# EAGLE schematic EEprom_Logger_V1_20202_04_13_A (EAGLE 9.4.2)
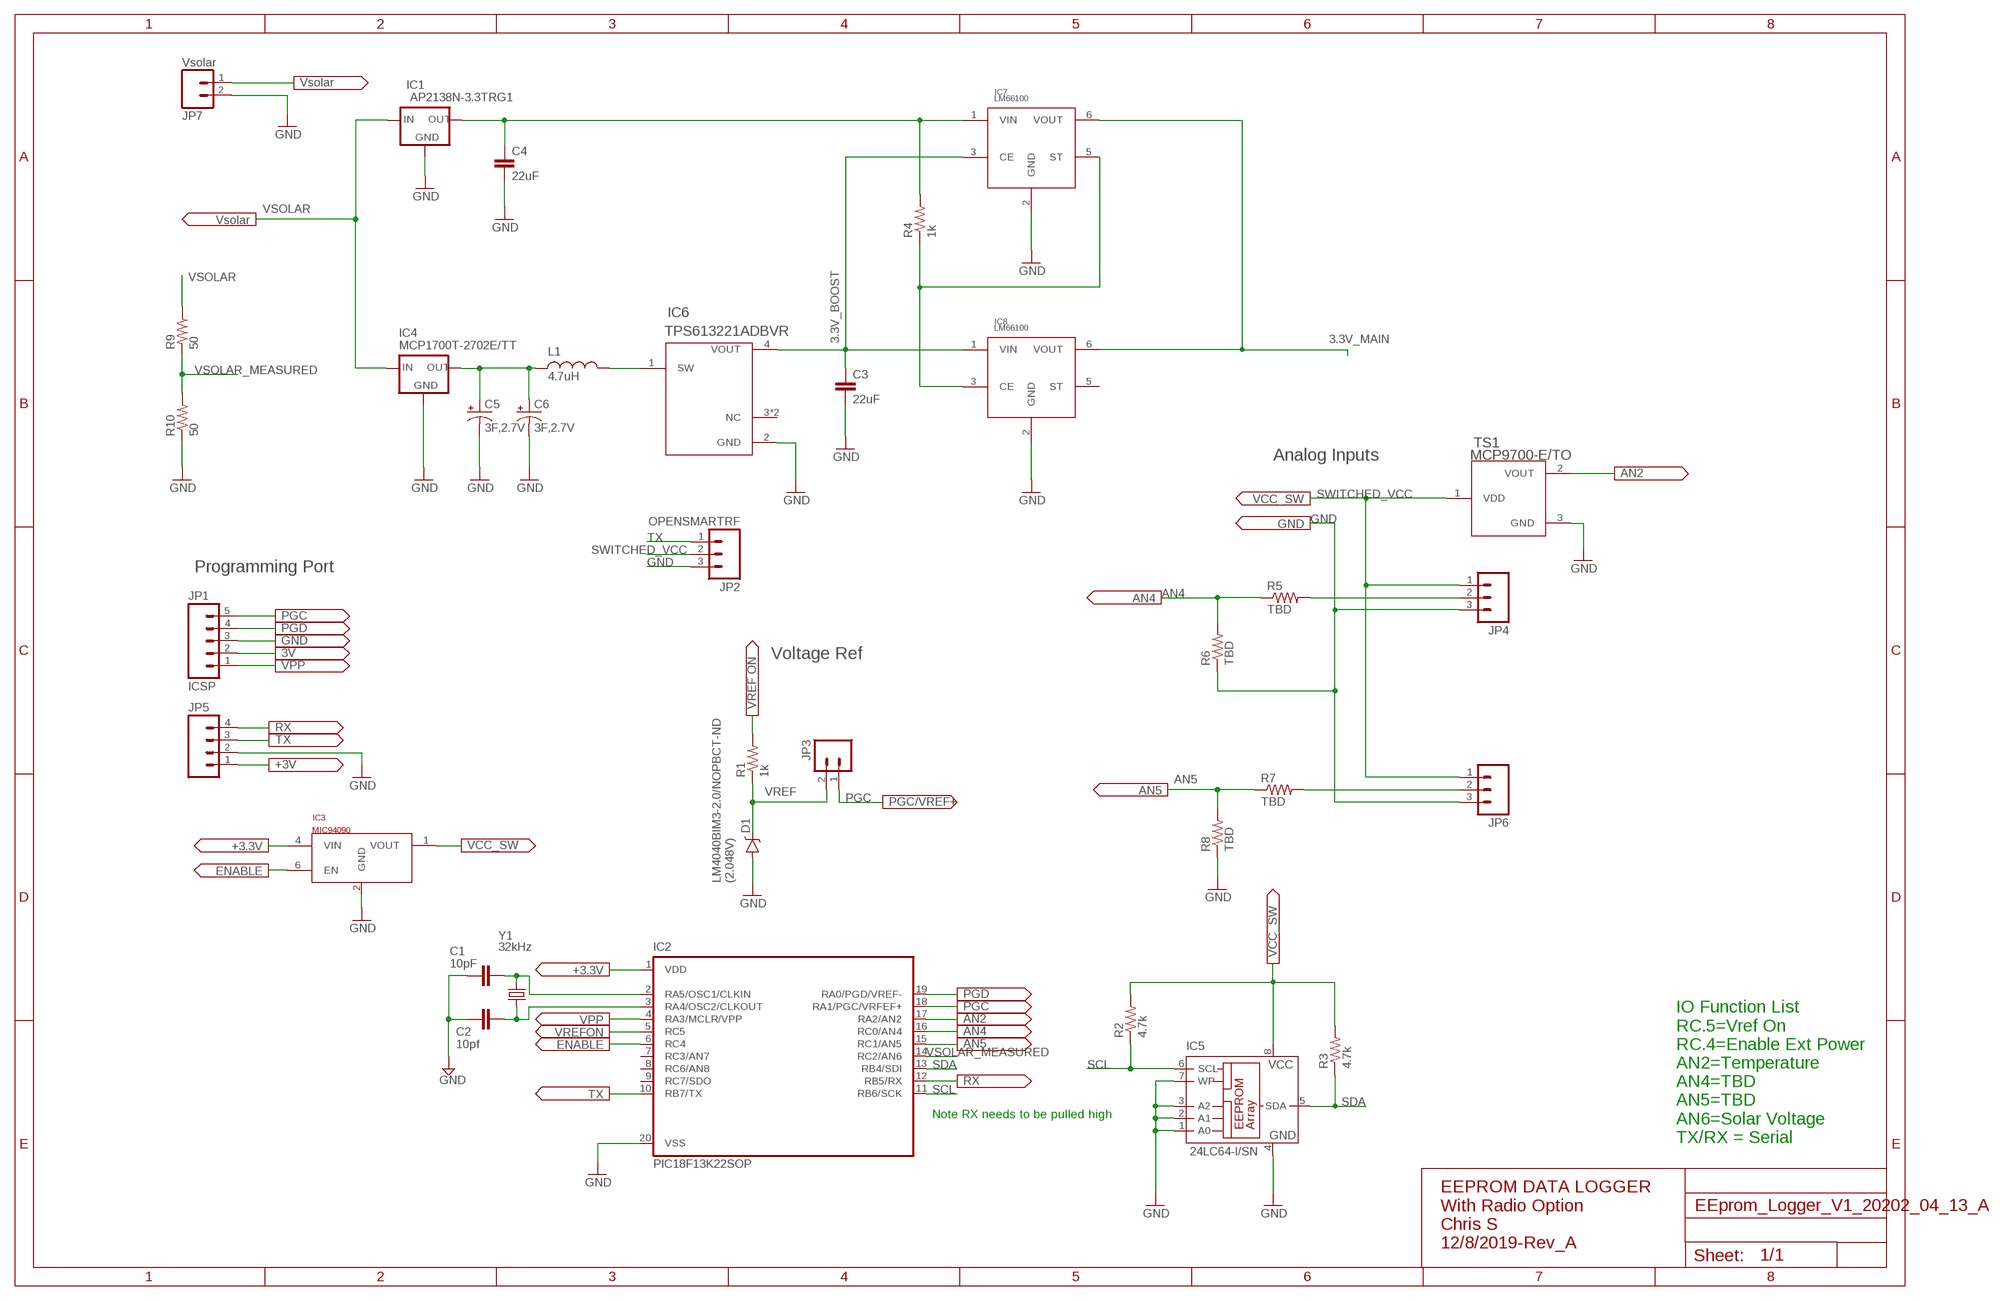
[diagram p0: schematic, sheet 1]

## Parts
C1  10pF  CAP1206  [1206]
C2  10pf  CAP1206  [1206]
C3  22uF  CAP1206  [1206]
C4  22uF  CAP1206  [1206]
C5  3F,2.7V  CPOL-USE3.5-8  [E3,5-8]
C6  3F,2.7V  CPOL-USE3.5-8  [E3,5-8]
D1  V-REFERENCESMD  [SOT23-3]
IC1  AP2138N-3.3TRG1  XC63FPM  [SOT23]
IC2  PIC18F13K22SOP  [SOP20W]
IC3  MIC94090  [SC-70]
IC4  MCP1700T-2702E/TT  XC63FPM  [SOT23]
IC5  24LC64-I/SN  24LC16BSN  [SO-08]
IC6  TPS613221ADBVR  TPS61322  [DBV5-L]
IC7  LM66100  [SC70-6]
IC8  LM66100  [SC70-6]
JP1  ICSP  M05PTH  [1X05]
JP2  OPENSMARTRF  M03LONGPADS  [1X03_LONGPADS@1]
JP3  M02LOCK  [1X02_LOCK]
JP4  455-1750-1-ND  CONN_03  [1X03]
JP5  M04PTH  [1X04]
JP6  455-1750-1-ND  CONN_03  [1X03]
JP7  Vsolar  CONN_02POLAR_LOCK  [MOLEX-1X2_LOCK@1]
L1  4.7uH  INDUCTOR1210  [1210]
R1  1k  RESISTOR1206  [1206]
R2  4.7k  RESISTOR1206  [1206]
R3  4.7k  RESISTOR1206  [1206]
R4  1k  RESISTOR1206  [1206]
R5  TBD  RESISTOR1206  [1206]
R6  TBD  RESISTOR1206  [1206]
R7  TBD  RESISTOR1206  [1206]
R8  TBD  RESISTOR1206  [1206]
R9  50  RESISTOR1206  [1206]
R10  50  RESISTOR1206  [1206]
TS1  MCP9700-E/TO  [TO-92-AMMO]
Y1  32kHz  CRYSTALTC26V  [TC26V]

## Nets
3.3V_BOOST: C3.2 IC6.4(VOUT) IC7.3(CE) IC8.1(VIN)
3.3V_MAIN: IC2.1(VDD) IC3.4(VIN) IC7.6(VOUT) IC8.6(VOUT) JP1.2 JP5.1
AN2: IC2.17(RA2/AN2) TS1.2(VOUT)
AN4: IC2.16(RC0/AN4) R5.1 R6.2
AN5: IC2.15(RC1/AN5) R7.1 R8.2
ENABLE: IC2.6(RC4) IC3.6(EN)
GND: C1.2 C2.2 C3.1 C4.1 C5.- C6.- D1.2(A) IC1.1(GND) IC2.20(VSS) IC3.2(GND) IC4.1(GND) IC5.1(A0) IC5.2(A1) IC5.3(A2) IC5.4(GND) IC5.7(WP) IC6.2(GND) IC7.2(GND) IC8.2(GND) JP1.3 JP2.3 JP4.3 JP5.2 JP6.3 JP7.2 R6.1 R8.1 R10.1 TS1.3(GND)
N$1: C1.1 IC2.2(RA5/OSC1/CLKIN) Y1.2
N$2: C2.1 IC2.3(RA4/OSC2/CLKOUT) Y1.1
N$3: C4.2 IC1.2(OUT) IC7.1(VIN) R4.2
N$4: C5.+ C6.+ IC4.2(OUT) L1.1
N$6: IC7.5(ST) IC8.3(CE) R4.1
N$7: JP4.2 R5.2
N$10: IC6.1(SW) L1.2
N$12: JP6.2 R7.2
PGC: IC2.18(RA1/PGC/VRFEF+) JP1.5 JP3.1
PGD: IC2.19(RA0/PGD/VREF-) JP1.4
RX: IC2.12(RB5/RX) JP5.4
SCL: IC2.11(RB6/SCK) IC5.6(SCL) R2.1
SDA: IC2.13(RB4/SDI) IC5.5(SDA) R3.1
SWITCHED_VCC: IC3.1(VOUT) IC5.8(VCC) JP2.2 JP4.1 JP6.1 R2.2 R3.2 TS1.1(VDD)
TX: IC2.10(RB7/TX) JP2.1 JP5.3
VPP: IC2.4(RA3/MCLR/VPP) JP1.1
VREF: D1.1(C) JP3.2 R1.1
VREFON: IC2.5(RC5) R1.2
VSOLAR: IC1.3(IN) IC4.3(IN) JP7.1 R9.1
VSOLAR_MEASURED: IC2.14(RC2/AN6) R9.2 R10.2
Unconnected: IC2.7(RC3/AN7) IC2.8(RC6/AN8) IC2.9(RC7/SDO) IC6.3(NC) IC6.5(NC) IC8.5(ST)

## Notes on the sheet
- Analog Inputs
- Programming Port
- Voltage Ref
- LM4040BIM3-2.0/NOPBCT-ND
  (2.048V)
- Note RX needs to be pulled high
- IO Function List
  RC.5=Vref On
  RC.4=Enable Ext Power
  AN2=Temperature
  AN4=TBD
  AN5=TBD
  AN6=Solar Voltage
  TX/RX = Serial
- EEPROM DATA LOGGER
  With Radio Option
  Chris S
  12/8/2019-Rev_A

## Library data of the parts
C1-C4 = SparkFun-Capacitors:CAP: Capacitor Standard 0603 ceramic capacitor, and 0.1" leaded capacitor.
C5 C6 = rcl:CPOL-US: POLARIZED CAPACITOR, American symbol; SPICEPREFIX: C
D1 = SparkFun-DiscreteSemi:V-REFERENCE: Zener diode
IC1 IC4 = v-reg:XC63FP: Positiv Voltage Regulators www.torex.co.jp/english/product/pro02/pdf/0201_xc62fp.pdf
IC2 = PIC18F13k22:PIC18F13K22?: 18/20/28-Pin High-Performance, Enhanced Flash Microcontrollers with 10-bit A/D and nanoWatt Technology Source: ww1.microchip.com/downloads/en/DeviceDoc/39605c.pdf
IC3 = MIC94090:MIC94090: MIC94090 Load switch 130mOhm ON 1.2A Conti. Current
IC5 = microchip:24*: Serial EEPROM I2C; MF: MICROCHIP; MPN: 24LC16B/SN; OC_FARNELL: 9757945; OC_NEWARK: 12C2012
IC6 = ‎TPS613221:TPS61322
IC7 IC8 = LM66100:LM66100
JP1 = SparkFun-Connectors:M05: Header 5 Standard 5-pin 0.1" header. Use with straight break away headers (SKU : PRT-00116), right angle break away headers (PRT-00553), swiss pins (PRT-00743), machine pins (PRT-00117), and female headers (PRT-00115). Molex polarized connector foot print use with SKU : PRT-08230 with associated crimp pins and housings.
JP2 = SparkFun-Connectors:M03: Header 3 Standard 3-pin 0.1" header. Use with straight break away headers (SKU : PRT-00116), right angle break away headers (PRT-00553), swiss pins (PRT-00743), machine pins (PRT-00117), and female headers (PRT-00115). Molex polarized connector foot print use with SKU : PRT-08232 with associated crimp pins and housings.
JP3 = SparkFun-Connectors:M02: Standard 2-pin 0.1" header. Use with - straight break away headers ( PRT-00116) - right angle break away headers (PRT-00553) - swiss pins (PRT-00743) - machine pins (PRT-00117) - female headers (PRT-00115) Molex polarized connector foot print use with: PRT-08233 with associated crimp pins and housings. 2.54_SCREWTERM for use with PRT-10571. 3.5mm Screw Terminal footprints for PRT-08084 5mm Screw Terminal footprints for use with PRT-08432
JP4 JP6 = SparkFun-Connectors:CONN_03: Multi connection point. Often used as Generic Header-pin footprint for 0.1 inch spaced/style header connections On any of the 0.1 inch spaced packages, you can populate with these: Break Away Headers - Straight <https://www.sparkfun.com/products/116> (PRT-00116) Break Away Male Headers - Right Angle <https://www.sparkfun.com/products/553> (PRT-00553) Female Headers <https://www.sparkfun.com/products/115> (PRT-00115) Break Away Headers - Machine Pin <https://www.sparkfun.com/products/117> (PRT-00117) Break Away Female Headers - Swiss Machine Pin <https://www.sparkfun.com/products/743> (PRT-00743) Stackable Header - 3 Pin (Female, 0.1") <https://www.sparkfun.com/products/13875> (PRT-13875) For SCREWTERMINALS and SPRING TERMINALS visit here: Screw Terimnals on SparkFun.com <https://www.sparkfun.com/search/results?term=Screw+Terminals> (5mm/3.5mm/2.54mm spacing) This device is also useful as a general connection point to wire up your design to another part of your project. Our various solder wires solder well into these plated through hole pads. Hook-Up Wire - Assortment (Stranded, 22 AWG) <https://www.sparkfun.com/products/11375> (PRT-11375) Hook-Up Wire - Assortment (Solid Core, 22 AWG) <https://www.sparkfun.com/products/11367> (PRT-11367) View the entire wire category on our website here <https://www.sparkfun.com/categories/141> Special notes: Molex polarized connector foot print use with SKU : PRT-08232 with associated crimp pins and housings.; PROD_ID: XXX-00000
JP5 = SparkFun-Connectors:M04: Header 4 Standard 4-pin 0.1" header. Use with straight break away headers (SKU : PRT-00116), right angle break away headers (PRT-00553), swiss pins (PRT-00743), machine pins (PRT-00117), and female headers (PRT-00115). Molex polarized connector foot print use with SKU : PRT-08231 with associated crimp pins and housings. 1MM SMD Version SKU: PRT-10208
JP7 = SparkFun-Connectors:CONN_02: Multi connection point. Often used as Generic Header-pin footprint for 0.1 inch spaced/style header connections On any of the 0.1 inch spaced packages, you can populate with these: Break Away Headers - Straight <https://www.sparkfun.com/products/116> (PRT-00116) Break Away Male Headers - Right Angle <https://www.sparkfun.com/products/553> (PRT-00553) Female Headers <https://www.sparkfun.com/products/115> (PRT-00115) Break Away Headers - Machine Pin <https://www.sparkfun.com/products/117> (PRT-00117) Break Away Female Headers - Swiss Machine Pin <https://www.sparkfun.com/products/743> (PRT-00743) For SCREWTERMINALS and SPRING TERMINALS visit here: Screw Terimnals on SparkFun.com <https://www.sparkfun.com/search/results?term=Screw+Terminals> (5mm/3.5mm/2.54mm spacing) This device is also useful as a general connection point to wire up your design to another part of your project. Our various solder wires solder well into these plated through hole pads. Hook-Up Wire - Assortment (Stranded, 22 AWG) <https://www.sparkfun.com/products/11375> (PRT-11375) Hook-Up Wire - Assortment (Solid Core, 22 AWG) <https://www.sparkfun.com/products/11367> (PRT-11367) View the entire wire category on our website here <https://www.sparkfun.com/categories/141> Special notes: Molex polarized connector foot print use with: PRT-08233 with associated crimp pins and housings. 2.54_SCREWTERM for use with PRT-10571. 3.5mm Screw Terminal footprints for PRT-08084 5mm Screw Terminal footprints for use with PRT-08432; SF_ID: PRT-09918
L1 = SparkFun-Passives:INDUCTOR: Inductors Basic Inductor/Choke - 0603 and 1206. Footprints are not proven and vary greatly between part numbers. SRN6045- 33uH, 20% 1.4A SDR0403-560KL - 56uH, 10%, 500mA RMS/740mA peak
R1-R10 = SparkFun-Resistors:RESISTOR: Resistor Basic schematic elements and footprints for 0603, 1206, and PTH resistors.
TS1 = MCP970X_Temp Sensors:MCP9700-E/TO
Y1 = crystal:CRYSTAL: CRYSTAL; OC_FARNELL: unknown; OC_NEWARK: unknown